# Altium schematic sheet t_junction.SchDoc
size A4
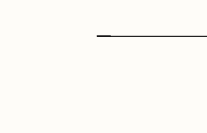
[diagram p0: t_junction.SchDoc, top left]
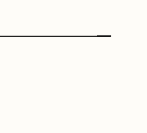
[diagram p1: t_junction.SchDoc, top right]
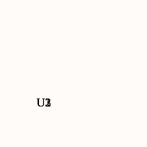
[diagram p2: t_junction.SchDoc, bottom left]

## Parts
U1  (no value)
U2  (no value)
U3  (no value)

## Nets
NetU1_1: U1.1(A) U2.1(B) U3.1(C)

## Library data of the parts
U1-U3 = DEVICE